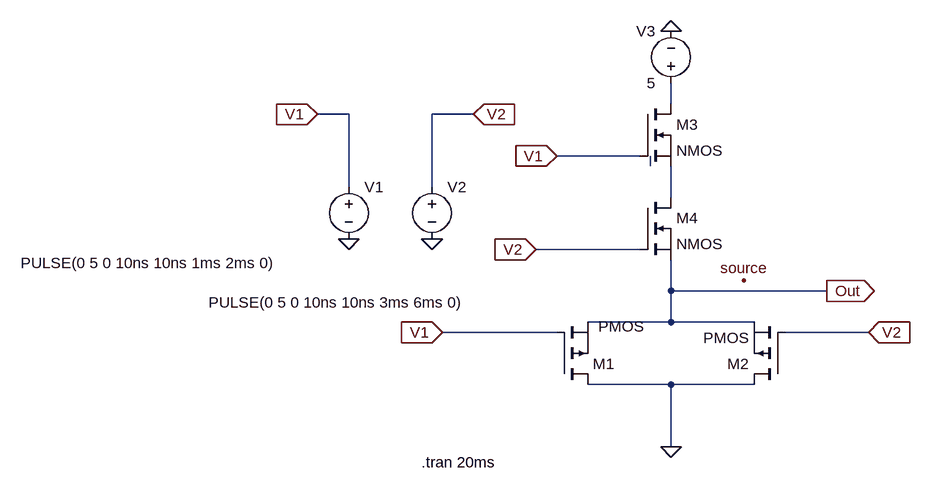
[diagram p0: schematic AND.asc]
AND.asc, the LTspice schematic file:
Version 4
SHEET 1 880 728
WIRE 64 160 64 128
WIRE -432 176 -480 176
WIRE -240 176 -304 176
WIRE 16 240 -112 240
WIRE 32 256 32 240
WIRE -432 288 -432 176
WIRE -304 288 -304 176
WIRE 64 304 64 256
WIRE 16 384 -144 384
WIRE 64 448 64 400
WIRE 304 448 64 448
WIRE 64 496 64 448
WIRE 64 496 -64 496
WIRE 192 496 64 496
WIRE -112 512 -288 512
WIRE 368 512 240 512
WIRE 64 592 -64 592
WIRE 192 592 64 592
WIRE 64 688 64 592
FLAG 64 48 0
FLAG 64 688 0
FLAG -304 368 0
FLAG 304 448 Out
IOPIN 304 448 Out
FLAG -144 384 V2
IOPIN -144 384 In
FLAG -112 240 V1
IOPIN -112 240 In
FLAG -288 512 V1
IOPIN -288 512 In
FLAG 368 512 V2
IOPIN 368 512 In
FLAG -480 176 V1
IOPIN -480 176 In
FLAG -240 176 V2
IOPIN -240 176 In
FLAG -432 368 0
FLAG 176 432 source
SYMBOL voltage 64 144 R180
WINDOW 0 24 96 Left 2
WINDOW 3 24 16 Left 2
WINDOW 123 0 0 Left 0
WINDOW 39 0 0 Left 0
SYMATTR InstName V3
SYMATTR Value 5
SYMBOL nmos 16 160 R0
SYMATTR InstName M3
SYMBOL nmos 16 304 R0
SYMATTR InstName M4
SYMBOL pmos -112 592 M180
WINDOW 3 64 89 Left 2
SYMATTR InstName M1
SYMBOL pmos 240 592 R180
SYMATTR InstName M2
SYMBOL voltage -304 272 R0
WINDOW 3 -344 194 Left 2
WINDOW 123 0 0 Left 0
WINDOW 39 0 0 Left 0
SYMATTR Value PULSE(0 5 0 10ns 10ns 3ms 6ms 0)
SYMATTR InstName V2
SYMBOL voltage -432 272 R0
WINDOW 3 -505 133 Left 2
WINDOW 123 0 0 Left 0
WINDOW 39 0 0 Left 0
SYMATTR Value PULSE(0 5 0 10ns 10ns 1ms 2ms 0)
SYMATTR InstName V1
TEXT -320 712 Left 2 !.tran 20ms

The netlist it stands for:
* AND.asc
V3 N001 0 5
M3 N001 V1 N003 N003 NMOS
M4 N003 V2 Out Out NMOS
M1 0 V1 Out Out PMOS
M2 0 V2 Out Out PMOS
V2 V2 0 PULSE(0 5 0 10ns 10ns 3ms 6ms 0)
V1 V1 0 PULSE(0 5 0 10ns 10ns 1ms 2ms 0)
.model NMOS NMOS
.model PMOS PMOS
.lib standard.mos
.tran 20ms
.backanno
.end